# EAGLE design SparkFun_Analog_MEMS_Microphone_Breakout_VM2020 (EAGLE 9.6.2)
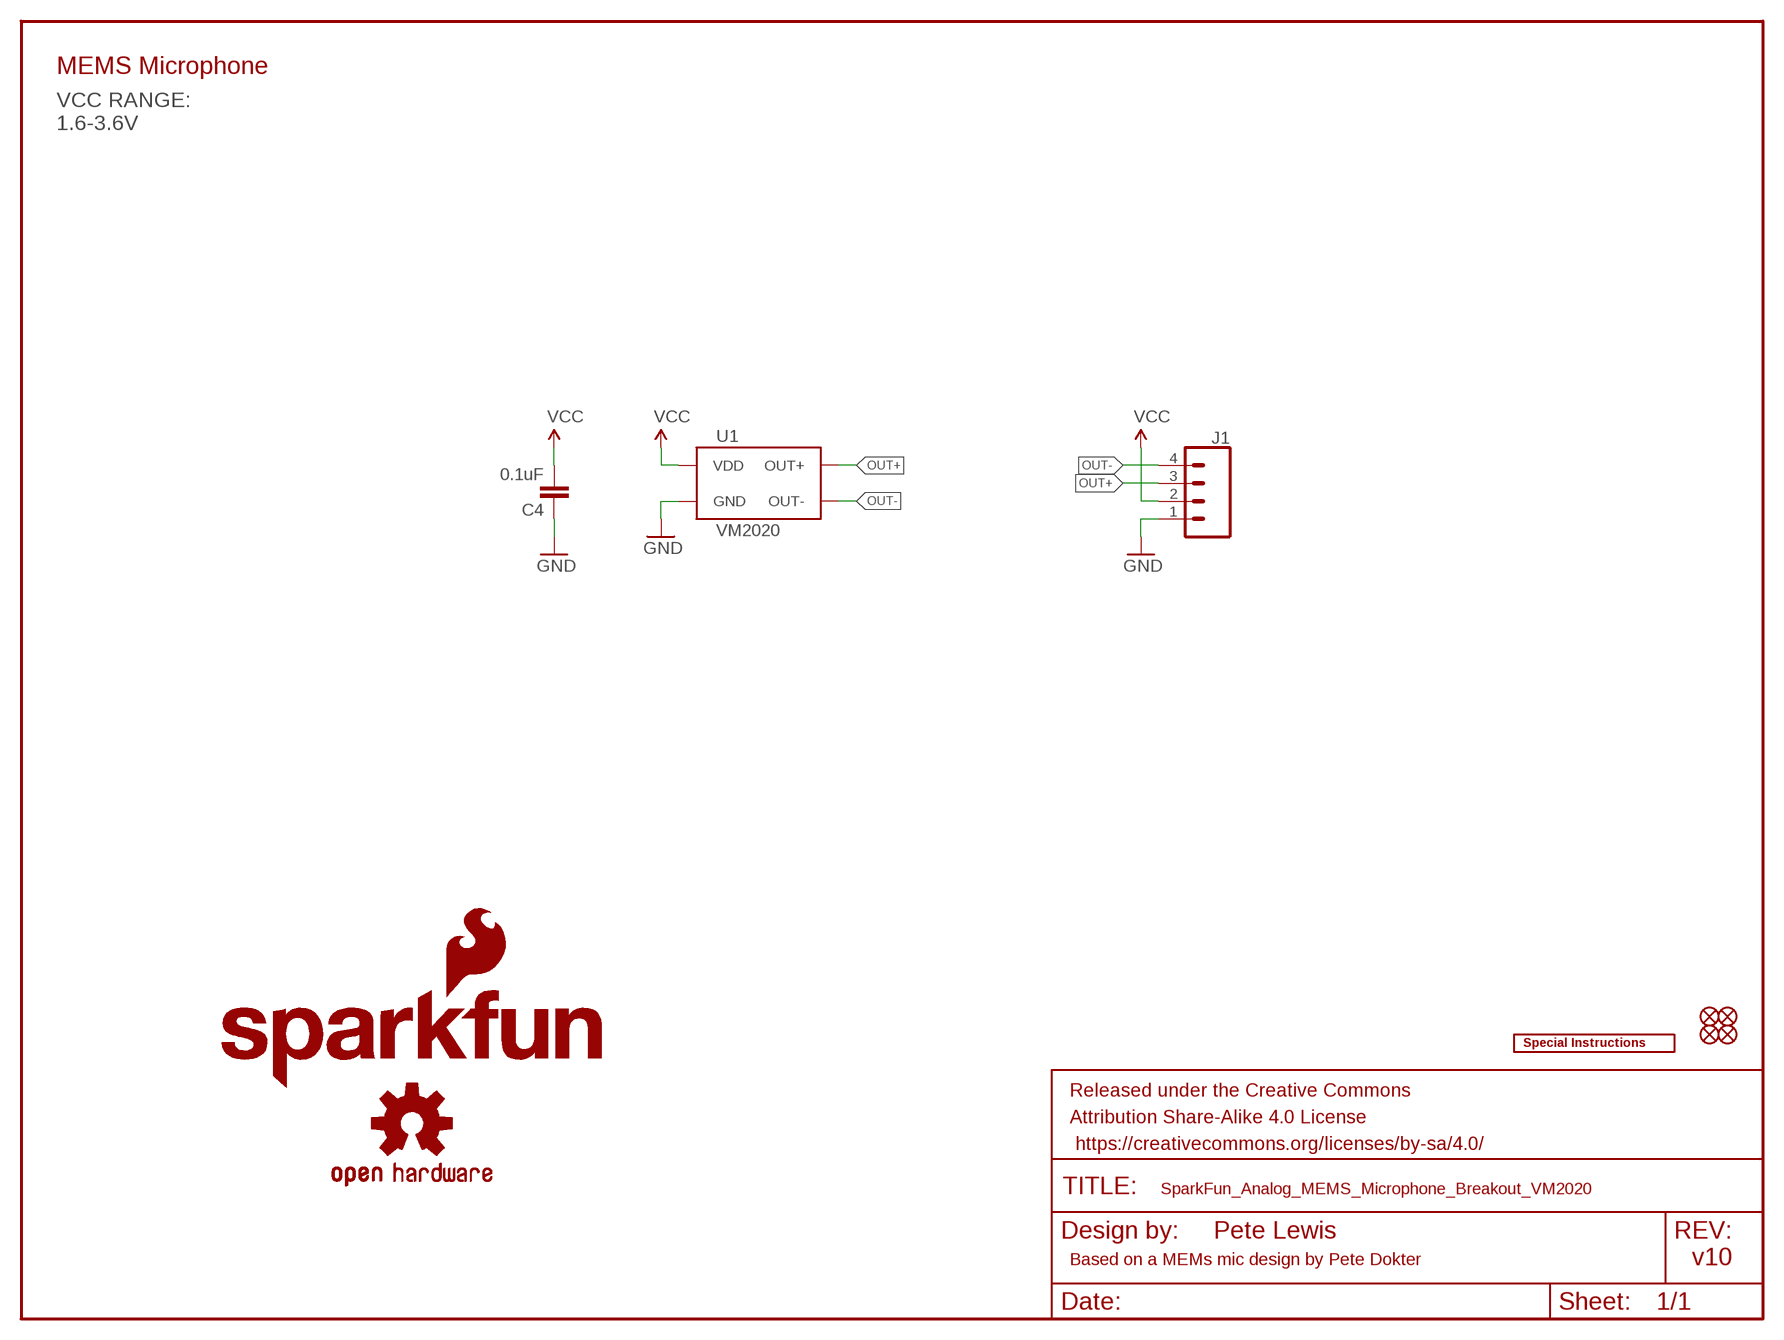
[diagram p0: schematic, sheet 1]

## Parts
C4  0.1uF  0.1UF-0603-25V-(+80/-20%)  [0603]
FD1  FIDUCIALUFIDUCIAL  [FIDUCIAL-MICRO]
FD2  FIDUCIALUFIDUCIAL  [FIDUCIAL-MICRO]
FD3  FIDUCIALUFIDUCIAL  [FIDUCIAL-MICRO]
FD4  FIDUCIALUFIDUCIAL  [FIDUCIAL-MICRO]
FRAME2  FRAME-LETTER  [CREATIVE_COMMONS]
J1  CONN_041X04_NO_SILK  [1X04_NO_SILK]
LOGO1  SFE_LOGO_FLAME.1_INCH  [SFE_LOGO_FLAME_.1]
LOGO2  OSHW-LOGOMINI  [OSHW-LOGO-MINI]
LOGO4  SPECIAL_INSTRUCTIONS-ORDERING  [ORDERING_INSTRUCTIONS]
U1  VM2020  [VM2020]

## Nets
GND: C4.1 J1.1 U1.2(GND) U1.3(GND) U1.4(GND) U1.5(GND) U1.8(GND)
OUT+: J1.3 U1.7(OUT+)
OUT-: J1.4 U1.1(OUT-)
VCC: C4.2 J1.2 U1.6(VDD)

## Notes on the sheet
- MEMS Microphone
- VCC RANGE:
  1.6-3.6V
- Pete Lewis
- Based on a MEMs mic design by Pete Dokter | v10

## Library data of the parts
C4 = SparkFun-Capacitors:0.1UF: 0.1µF ceramic capacitors A capacitor is a passive two-terminal electrical component used to store electrical energy temporarily in an electric field.; PROD_ID: CAP-00810
FD1-FD4 = SparkFun-Aesthetics:FIDUCIAL: Fiducial Alignment Points Point-of-reference for pick-and-place machines and other optical instruments.
FRAME2 = SparkFun-Aesthetics:FRAME-LETTER: Schematic Frame - Letter Standard 8.5x11 US Letter frame
J1 = SparkFun-Connectors:CONN_04: Multi connection point. Often used as Generic Header-pin footprint for 0.1 inch spaced/style header connections On any of the 0.1 inch spaced packages, you can populate with these: Break Away Headers - Straight <https://www.sparkfun.com/products/116> (PRT-00116) Break Away Male Headers - Right Angle <https://www.sparkfun.com/products/553> (PRT-00553) Female Headers <https://www.sparkfun.com/products/115> (PRT-00115) Break Away Headers - Machine Pin <https://www.sparkfun.com/products/117> (PRT-00117) Break Away Female Headers - Swiss Machine Pin <https://www.sparkfun.com/products/743> (PRT-00743) For SCREWTERMINALS and SPRING TERMINALS visit here: Screw Terimnals on SparkFun.com <https://www.sparkfun.com/search/results?term=Screw+Terminals> (5mm/3.5mm/2.54mm spacing) This device is also useful as a general connection point to wire up your design to another part of your project. Our various solder wires solder well into these plated through hole pads. Hook-Up Wire - Assortment (Stranded, 22 AWG) <https://www.sparkfun.com/products/11375> (PRT-11375) Hook-Up Wire - Assortment (Solid Core, 22 AWG) <https://www.sparkfun.com/products/11367> (PRT-11367) View the entire wire category on our website here <https://www.sparkfun.com/categories/141> Special notes: Molex polarized connector foot print use with SKU : PRT-08231 with associated crimp pins and housings. 1MM SMD Version SKU: PRT-10208; PROD_ID: CONN-09696
LOGO1 = SparkFun-Aesthetics:SFE_LOGO_FLAME: SparkFun Flame Logo This is the SparkFun flame logo. The logo on the schematic will always be the same size; the package variant is the height of the flame. Default layer for the logo on the board is tSilk.
LOGO2 = SparkFun-Aesthetics:OSHW-LOGO: Open-Source Hardware (OSHW) Logo This logo indicates the piece of hardware it is found on incorporates a OSHW license and/or adheres to the definition of open source hardware found here: http://freedomdefined.org/OSHW
LOGO4 = SparkFun-Aesthetics:SPECIAL_INSTRUCTIONS: Special Ordering/Production Instructions Alert Symbol for special PCB ordering instructions or unique production process warnings. Ordering Instructions Production Instructions Types of information that should be added to box: Copper weight Soldermask color Silk color PCB thickness Number of layers PCB Standard: 1.6mm FR4 1 oz copper immersion silver plating red soldermask white silkscreen Types of information that should be added to box: Special wash requirements Depaneling instructions Humidification Glue curing Default text settings: 0.07 inch 9% ratio 50% line distance
U1 = vm2020:VM2020: Vesper Technologies VM2020 The VM2020 is an ultra-high AOP, high dynamic range, differential analog output piezoelectric MEMS microphone. This microphone consists of a piezoelectric sensor and circuitry to buffer and amplify the output. It has an acoustic overload point of 152dB SPL for audio capture in loud environments. The VM2020 has a small 3.76 mm X 2.95 mm X 1.3 mm package. This microphone is reflow solder compatible with no sensitivity degradation.; MANU_PART: VM2020; PROD_ID: IC-17514

## Board
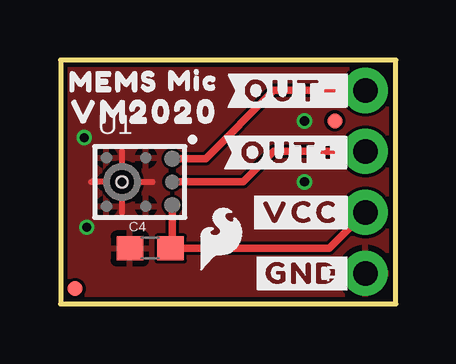
[diagram p1: board, top side]
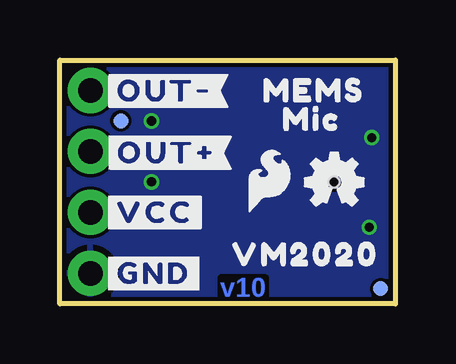
[diagram p2: board, bottom side, seen from below]

Size 13.97 x 10.16 mm. Coordinates in mm from the lower left corner, seen from the top.
Outline: 0,0 13.97,0 13.97,10.16 0,10.16 0,0
Copper layers (1*16): Top 0.035mm / dielectric 1.5mm / Bottom 0.035mm
Design rules "SparkFun-2-Layer-Minimum-JLCPCB": minimum track width 5mil, minimum drill 0.3mm, track to track 5mil, track to pad 5mil, pad to pad 5mil, via to via 5mil, smd to smd 5mil, copper to edge 7mil, drill to drill 7mil, minimum pad ring 5mil, minimum via ring 5mil, stop-mask expansion 2.5mil, vias tented up to drill 25mil, thermal gap 10mil

### Footprints (pad centres in the part's own frame; a part is rotated, then mirrored left to right if it is on the bottom)
0603 = smd 1.1 x 1: 1 -0.85,0; 2 0.85,0
FIDUCIAL-MICRO = smd 0.635 x 0.635: 1 0,0
1X04_NO_SILK = drill 1.016 pad 1.88: 1 0,0; 2 2.54,0; 3 5.08,0; 4 7.62,0
VM2020 = smd 0.65 x 0.65: 1 1.35,0.965; 6 1.35,-0.965 | smd 0.46 x 0.46: 2 0.25,1.015; 3 -1.39,1.015; 4 -1.39,-1.015; 5 0.25,-1.015 | smd 0.6 x 0.6: 7 1.35,0 | smd 0.25 x 0.25: 8 -1.38,0 | hole 0.457: -0.75,0

### Placement (x,y rotation side)
C4  3.73,2.31 0 top
FD1  11.43,7.62 0 top
FD2  11.43,7.62 0 bottom
FD3  0.61,0.64 0 top
FD4  0.61,0.64 0 bottom
FRAME2  -19.05,-11.43 0 top  (outside the outline)
J1  12.7,1.27 90 top
LOGO1  5.26,5.13 0 bottom
LOGO2  2.54,5.08 0 bottom
LOGO3  SFE_LOGO_FLAME.1_INCH  [SFE_LOGO_FLAME_.1]  6.68,2.72 0 top
LOGO4  22.86,50.8 0 top  (outside the outline)
U1  3.3,5.08 0 top
U$3  [#OUT##15]  9.55,6.3 0 top
U$4  [#OUT##18]  9.55,6.29 0 bottom
U$5  [#GND#11]  10.05,1.27 0 top
U$6  [VM20200]  3.74,2.06 0 bottom
U$7  [MEMS23]  3.39,8.89 0 bottom
U$8  [VM20200]  3.5,8 0 top
U$9  [#GND#11]  10.06,1.27 0 bottom
U$10  [#VCC#12]  10.01,3.81 0 top
U$11  [#VCC#12]  10.02,3.8 0 bottom
U$12  [#OUT##19]  9.62,8.87 0 bottom
U$13  [#OUT##20]  9.63,8.88 0 top
U$14  [MEMS21]  2.21,9.25 0 top
U$15  [MIC22]  5.52,9.3 0 top
U$16  [MIC24]  3.49,7.69 0 bottom

### Tracks (layer width: path | path; a pad name or v marks a point on that pad's centre or on a via)
GND  (via drill 0.38)
  Top 0.254: U1.8 1.27,5.08 | 2.56,4.45 2.56,3.8 | 3.18,5.08 3.83,5.08 | 2.56,5.72 2.56,6.37
  other vias: 1.09,3.19 10.16,7.62 10.16,5.08 0.98,6.93
  pour Bottom: 0,0 0,10.16 13.97,10.16 13.97,0
  pour Top: 0,0 0,10.16 13.97,10.16 13.97,0
OUT+
  Top 0.305: U1.7 7.62,5.08 8.89,6.35 J1.3
OUT-
  Top 0.305: U1.1 6.04,6.04 8.89,8.89 J1.4
VCC
  Top 0.305: J1.2 11.2,2.31 C4.2 4.65,2.38 U1.6

### Text on the board
Bottom: v10
tValues: Mic Breakout
Measures: Units: INCHES
tDocu: Board Thickness is 1.6mm | Pete Lewis | Based on a MEMs mic design by Pete Dokter